# EasyEDA schematic EasyEDA_schematic.json
TITLE: Sheet_1; REV: 1.0; Date: 2023-08-28; Sheet: 1/1; Drawn By: sb2; Company: Your Company
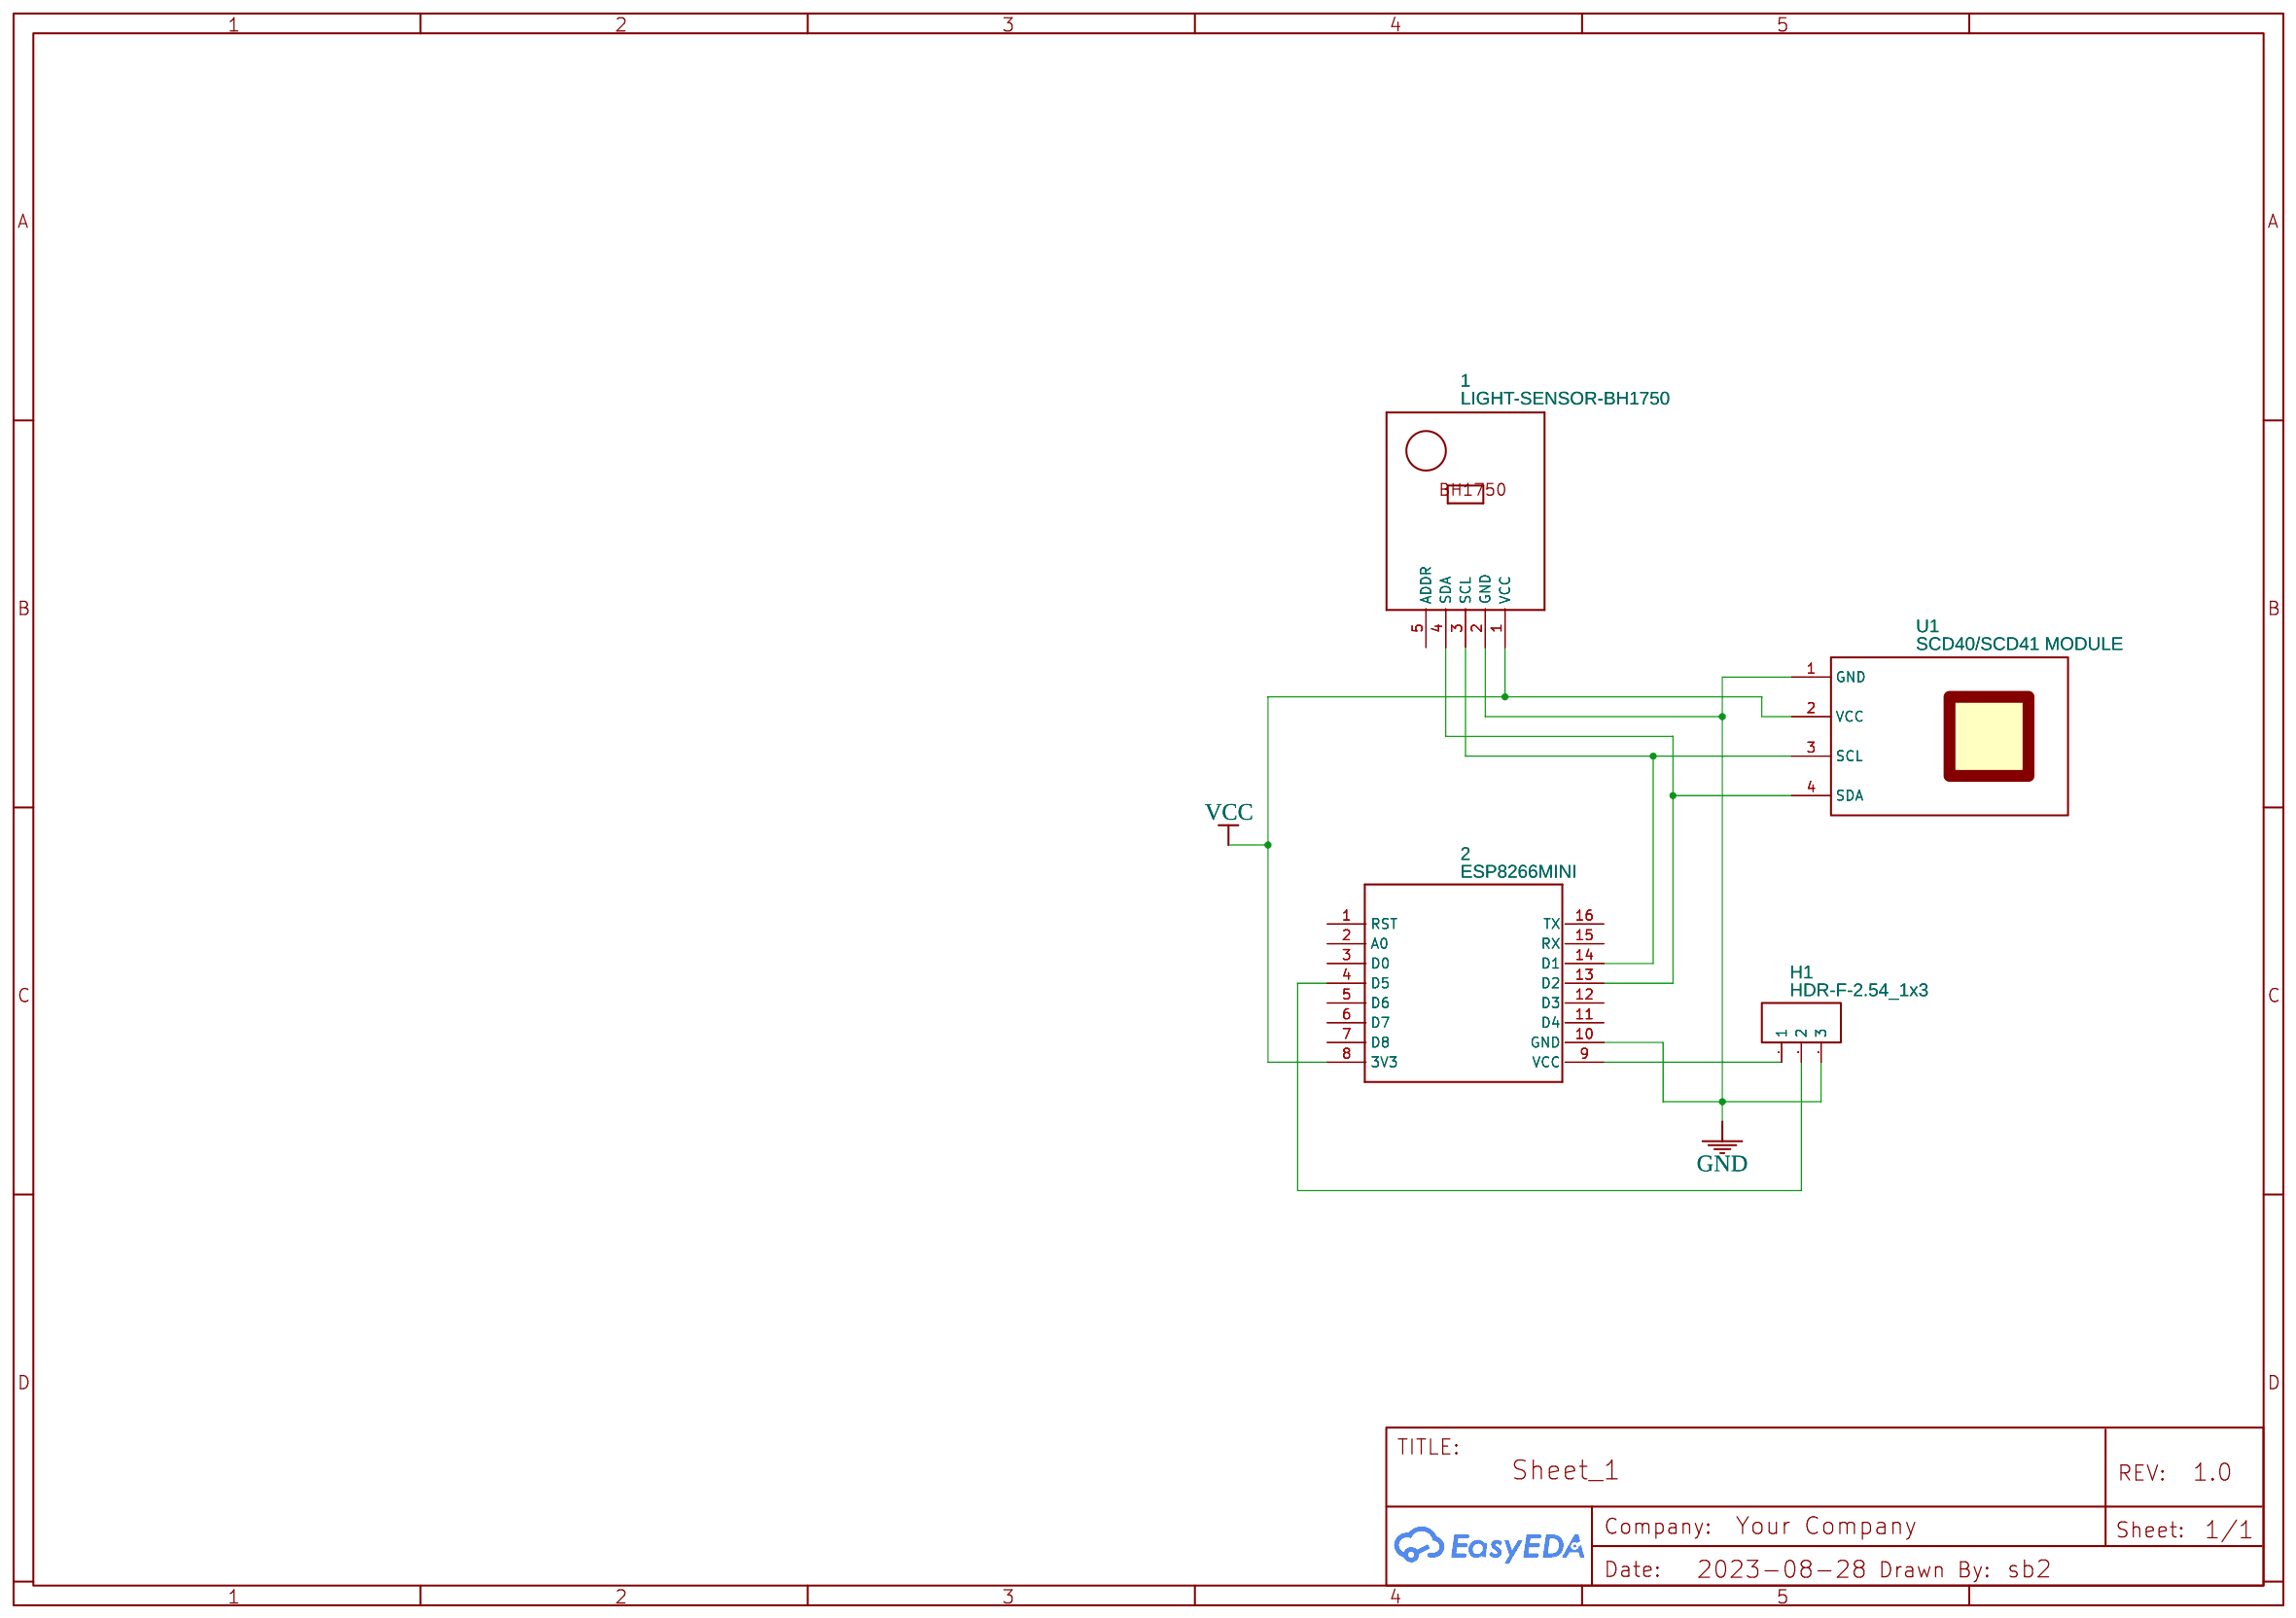
[diagram p0: schematic sheet]

## Parts
1  LIGHT-SENSOR-BH1750  [LIGHT-SENSOR-BH1750]
2  ESP8266MINI  [ESP8266MINI]
H1  HDR-F-2.54_1x3  [HDR-F-2.54_1X3]
U1  SCD40/SCD41 MODULE  [SCD40/SCD41 MODULE]

## Library data of the parts
1 = LIGHT-SENSOR-BH1750: Contributor: khajavali
2 = ESP8266MINI: Contributor: kevinbrice
H1 = HDR-F-2.54_1x3: Supplier Part: C146690; Supplier: LCSC; Contributor: LCEDA_Lib
U1 = SCD40/SCD41 MODULE: Contributor: xyzroe

## Nets
GND: 1.2(GND) 2.10(GND) H1.3 U1.1(GND)
VCC: 1.1(VCC) 2.8(3V3) U1.2(VCC)
Net-(1-3): 1.3(SCL) 2.14(D1) U1.3(SCL)
Net-(1-4): 1.4(SDA) 2.13(D2) U1.4(SDA)
Net-(2-4): 2.4(D5) H1.2
Net-(2-9): 2.9(VCC) H1.1

Not connected (* = marked no-connect by the designer): 1 5(ADDR); 2 1(RST) 2(A0) 3(D0) 5(D6) 6(D7) 7(D8) 11(D4) 12(D3) 15(RX) 16(TX)
